# EAGLE schematic USB_board (EAGLE 8.0.1)
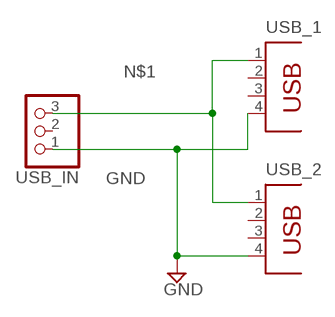
[diagram p0: schematic, sheet 1]

## Parts
USB_1  PN87520  [PN87520]
USB_2  PN87520  [PN87520]
USB_IN  PINHD-1X3  [1X03]

## Nets
GND: USB_1.4 USB_2.4 USB_IN.1
N$1: USB_1.1 USB_2.1 USB_IN.3
Unconnected: USB_1.2 USB_1.3 USB_2.2 USB_2.3 USB_IN.2

## Library data of the parts
USB_1 USB_2 = con-berg:PN87520: BERG USB connector; OC_FARNELL: unknown; OC_NEWARK: unknown
USB_IN = pinhead:PINHD-1X3: PIN HEADER